# EAGLE schematic PicoCC (EAGLE 6.1)
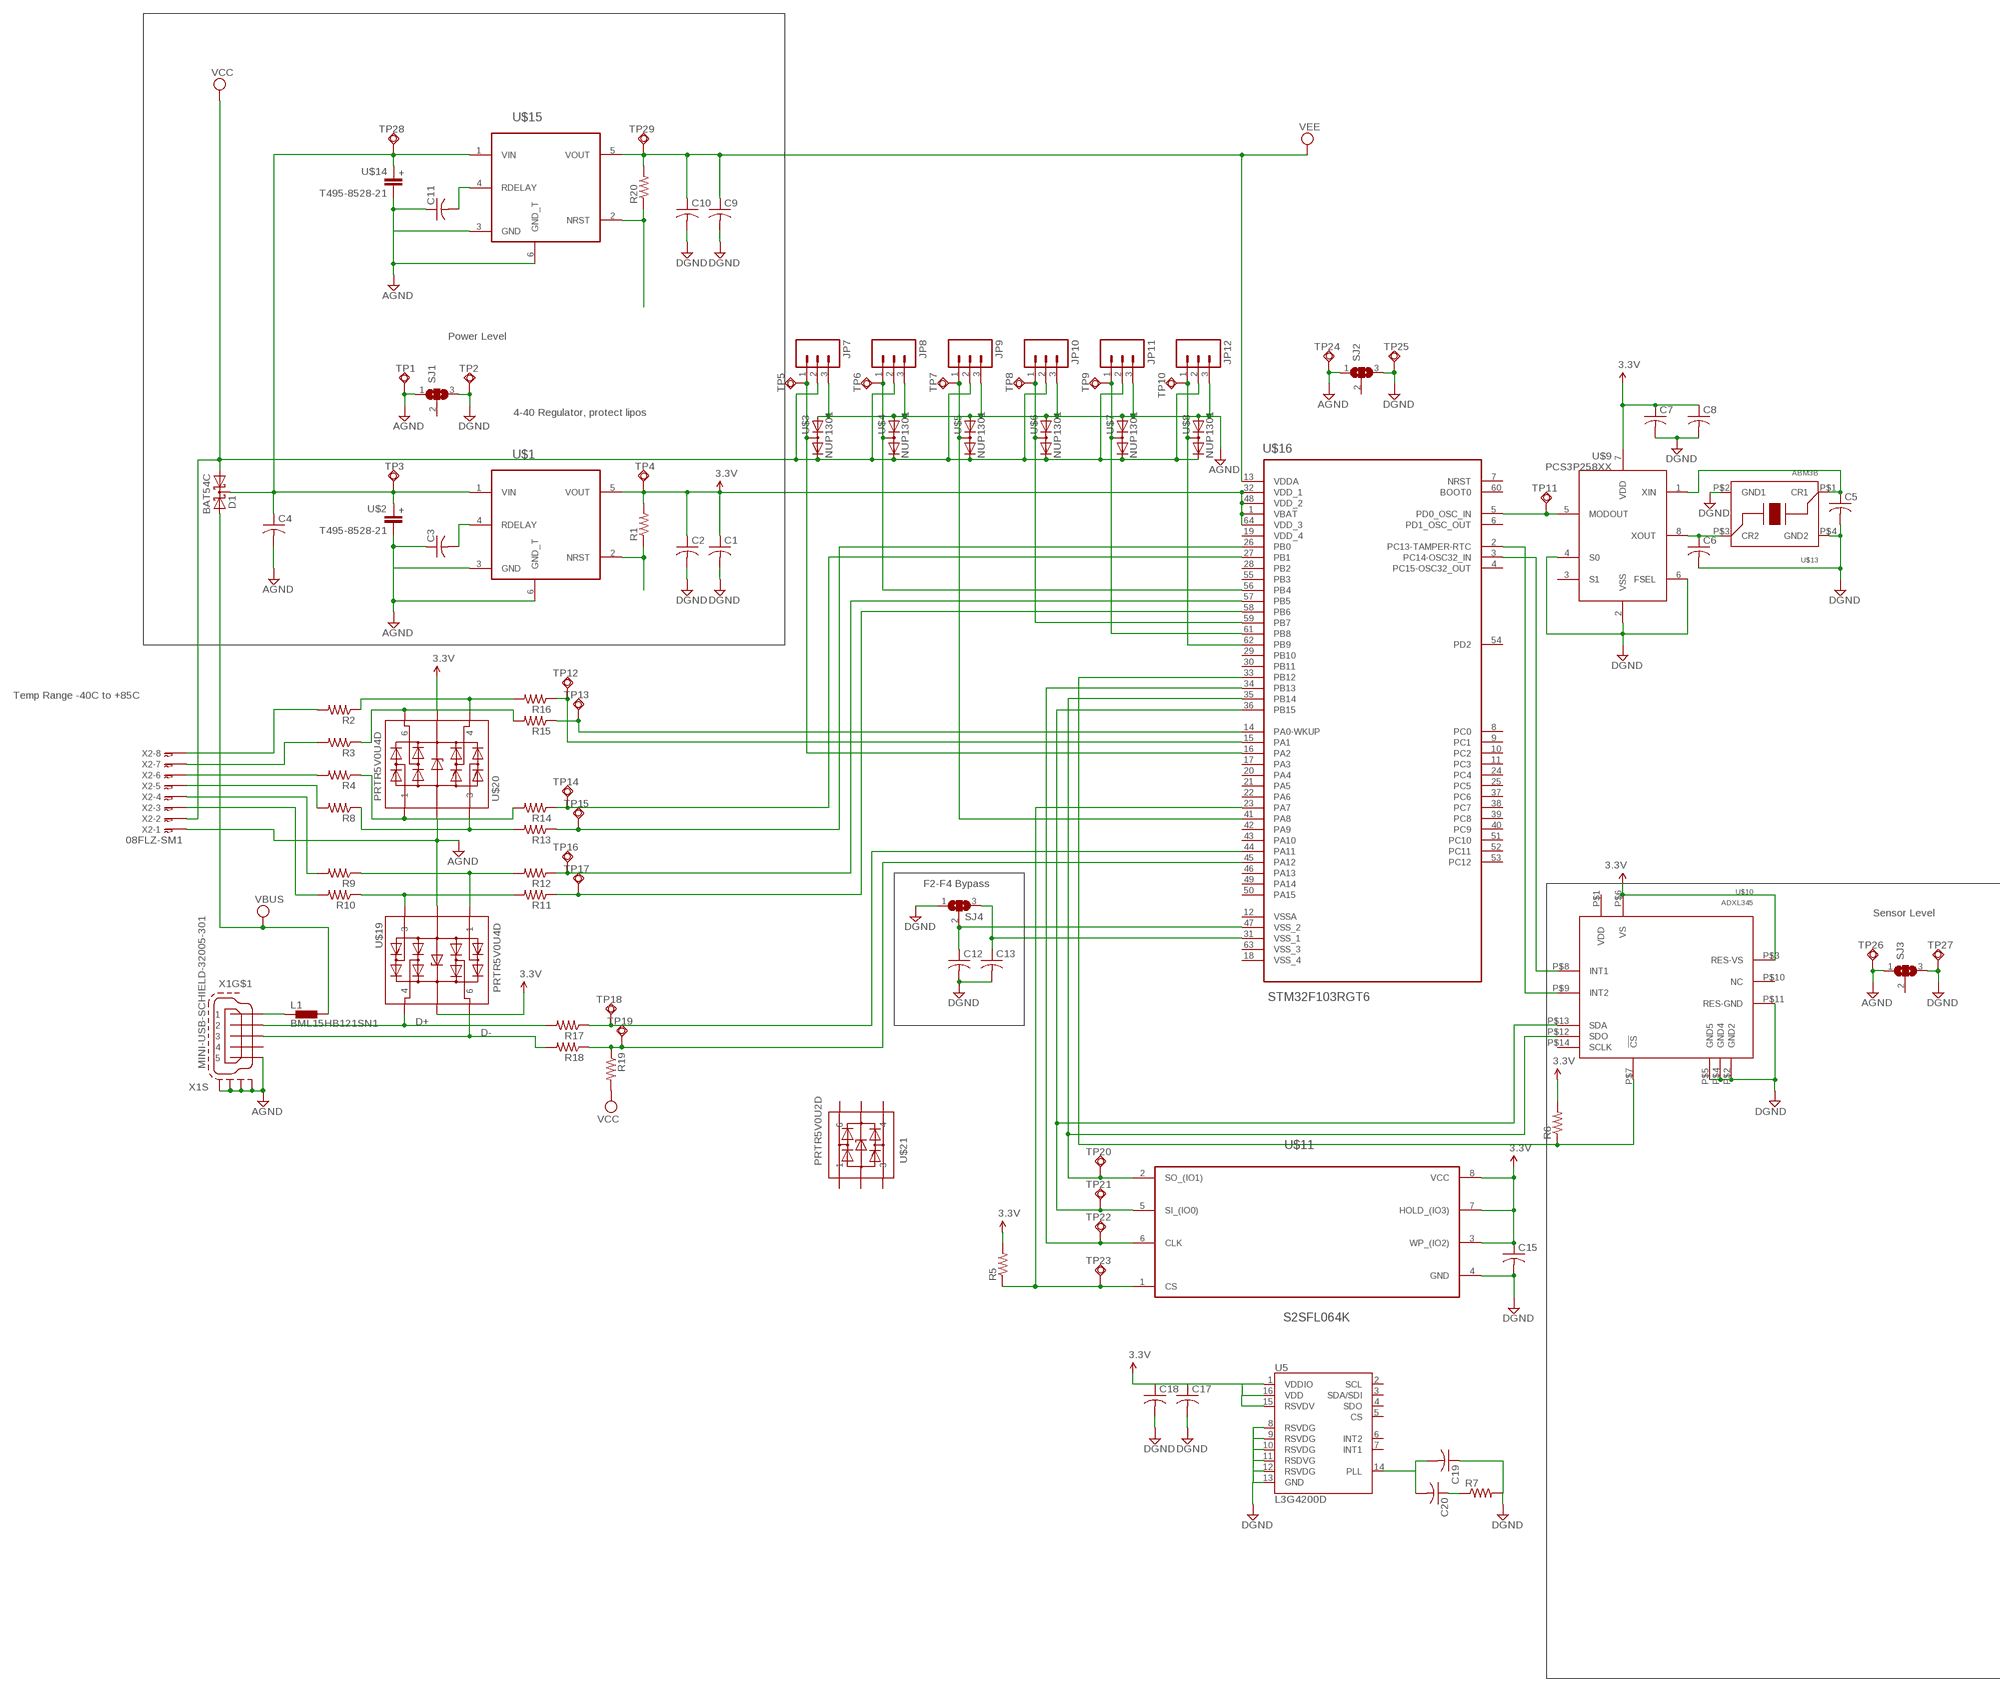
[diagram p0: schematic, sheet 1, part 1 of 2]
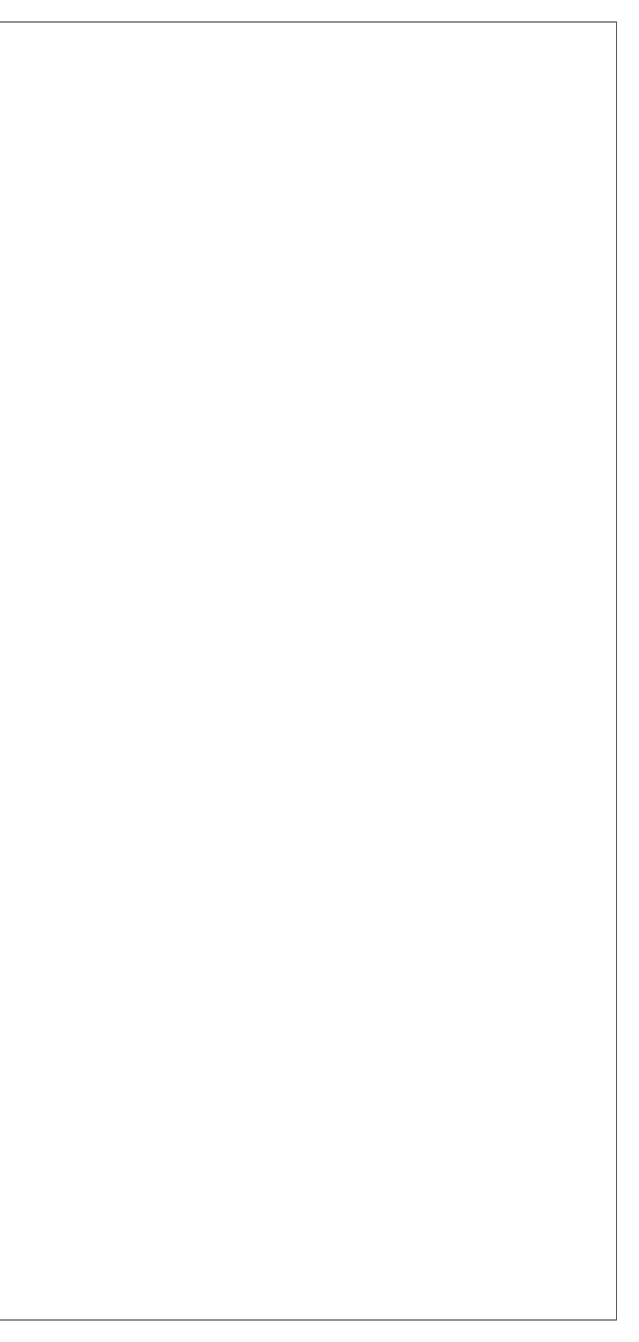
[diagram p1: schematic, sheet 1, part 2 of 2]

## Parts
C1  C-USC0402  [C0402]
C2  C-USC0402  [C0402]
C3  C-USC0402K  [C0402K]
C4  C-USC0402K  [C0402K]
C5  C-USC0402K  [C0402K]
C6  C-USC0402K  [C0402K]
C7  C-USC0402K  [C0402K]
C8  C-USC0402K  [C0402K]
C9  C-USC0402  [C0402]
C10  C-USC0402  [C0402]
C11  C-USC0402K  [C0402K]
C12  C-USC0402  [C0402]
C13  C-USC0402  [C0402]
C15  C-USC0402K  [C0402K]
C17  C-USC0402  [C0402]
C18  C-USC0402  [C0402]
C19  C-USC0402  [C0402]
C20  C-USC0402  [C0402]
D1  BAT54C  [SOT23]
JP7  M03POGO_PIN_HOLES_ONLY  [1X03_PP_HOLES_ONLY]
JP8  M03POGO_PIN_HOLES_ONLY  [1X03_PP_HOLES_ONLY]
JP9  M03POGO_PIN_HOLES_ONLY  [1X03_PP_HOLES_ONLY]
JP10  M03POGO_PIN_HOLES_ONLY  [1X03_PP_HOLES_ONLY]
JP11  M03POGO_PIN_HOLES_ONLY  [1X03_PP_HOLES_ONLY]
JP12  M03POGO_PIN_HOLES_ONLY  [1X03_PP_HOLES_ONLY]
L1  BML15HB121SN1  [0402]
R1  R-US_R0402  [R0402]
R2  R-US_R0402  [R0402]
R3  R-US_R0402  [R0402]
R4  R-US_R0402  [R0402]
R5  R-US_R0402  [R0402]
R6  R-US_R0402  [R0402]
R7  R-US_R0402  [R0402]
R8  R-US_R0402  [R0402]
R9  R-US_R0402  [R0402]
R10  R-US_R0402  [R0402]
R11  R-US_R0402  [R0402]
R12  R-US_R0402  [R0402]
R13  R-US_R0402  [R0402]
R14  R-US_R0402  [R0402]
R15  R-US_R0402  [R0402]
R16  R-US_R0402  [R0402]
R17  R-US_R0402  [R0402]
R18  R-US_R0402  [R0402]
R19  R-US_R0402  [R0402]
R20  R-US_R0402  [R0402]
SJ1  SJ2WW  [SJ_2W]
SJ2  SJ2WW  [SJ_2W]
SJ3  SJ2WW  [SJ_2W]
SJ4  SJ2W  [SJ_2]
TP1  TPSQTP12R  [TP12R]
TP2  TPSQTP12R  [TP12R]
TP3  TPSQTP12R  [TP12R]
TP4  TPSQTP12R  [TP12R]
TP5  TPSQTP12R  [TP12R]
TP6  TPSQTP12R  [TP12R]
TP7  TPSQTP12R  [TP12R]
TP8  TPSQTP12R  [TP12R]
TP9  TPSQTP12R  [TP12R]
TP10  TPSQTP12R  [TP12R]
TP11  TPSQTP12R  [TP12R]
TP12  TPSQTP12R  [TP12R]
TP13  TPSQTP12R  [TP12R]
TP14  TPSQTP12R  [TP12R]
TP15  TPSQTP12R  [TP12R]
TP16  TPSQTP12R  [TP12R]
TP17  TPSQTP12R  [TP12R]
TP18  TPSQTP12R  [TP12R]
TP19  TPSQTP12R  [TP12R]
TP20  TPSQTP12R  [TP12R]
TP21  TPSQTP12R  [TP12R]
TP22  TPSQTP12R  [TP12R]
TP23  TPSQTP12R  [TP12R]
TP24  TPSQTP12R  [TP12R]
TP25  TPSQTP12R  [TP12R]
TP26  TPSQTP12R  [TP12R]
TP27  TPSQTP12R  [TP12R]
TP28  TPSQTP12R  [TP12R]
TP29  TPSQTP12R  [TP12R]
U5  L3G4200D  [LGA16-4X4]
U$1  TPS7A6033-Q1  [TO-263-5]
U$2  T495-8528-21  [8528-21]
U$3  NUP1301  [SOT-23]
U$4  NUP1301  [SOT-23]
U$5  NUP1301  [SOT-23]
U$6  NUP1301  [SOT-23]
U$7  NUP1301  [SOT-23]
U$8  NUP1301  [SOT-23]
U$9  PCS3P258XX  [SO08]
U$10  ADXL345  [LGA14]
U$11  S2SFL064K  [SOIC127P600X175-8N]
U$13  ABM3B  [ABM3B]
U$14  T495-8528-21  [8528-21]
U$15  TPS7A6033-Q1  [TO-263-5]
U$16  STM32F103RGT6  [QFP50P1200X1200X160-64N]
U$19  PRTR5V0U4D  [SOT-457]
U$20  PRTR5V0U4D  [SOT-457]
U$21  PRTR5V0U2D  [SOT-457]
X1  MINI-USB-SCHIELD-32005-301  [32005-301]
X2  08FLZ-SM1  [8FLZ-SM]

## Nets
3.3V: C1.1 C2.1 C7.1 C8.1 C15.1 C17.1 C18.1 R1.2 R3.1 R5.2 R6.2 R15.2 TP4.TP U5.1(VDDIO) U5.15(RSVDV) U5.16(VDD) U$1.5(VOUT) U$9.7(VDD) U$10.P$3(RES-VS) U$10.P$6(VS) U$11.3(WP_(IO2)) U$11.7(HOLD_(IO3)) U$11.8(VCC) U$16.1(VBAT) U$16.32(VDD_1) U$16.48(VDD_2) U$16.64(VDD_3) U$19.5 U$20.6
AGND: C3.1 C4.2 C11.1 JP7.3 JP8.3 JP9.3 JP10.3 JP11.3 JP12.3 SJ1.1 SJ2.1 SJ3.1 TP1.TP TP24.TP TP26.TP U$1.3(GND) U$1.6(GND_T) U$2.NEG U$3.1 U$4.1 U$5.1 U$6.1 U$7.1 U$8.1 U$14.NEG U$15.3(GND) U$15.6(GND_T) U$19.2 U$20.2 X1.5 X1.M1(S:S1) X1.M2(S:S2) X1.M3(S:S3) X1.M4(S:S4) X2.1
D+: R17.2 U$19.4 X1.2
D+2: R17.1 TP18.TP U$16.44(PA11)
D-: R18.2 U$19.6 X1.3
D-2: R18.1 R19.1 TP19.TP U$16.45(PA12)
DGND: C1.2 C2.2 C5.2 C6.2 C7.2 C8.2 C9.2 C10.2 C12.2 C13.2 C15.2 C17.2 C18.2 C19.1 R7.2 SJ1.3 SJ2.3 SJ3.3 SJ4.1 TP2.TP TP25.TP TP27.TP U5.8(RSVDG) U5.9(RSVDG) U5.10(RSVDG) U5.11(RSDVG) U5.12(RSVDG) U5.13(GND) U$9.2(VSS) U$9.4(S0) U$9.6(FSEL) U$10.P$2(GND2) U$10.P$4(GND4) U$10.P$5(GND5) U$10.P$11(RES-GND) U$11.4(GND) U$13.P$2(GND1) U$13.P$4(GND2)
N$1: L1.1 X1.1
N$2: C4.1 D1.3(CC) TP3.TP TP28.TP U$1.1(VIN) U$2.POS U$14.POS U$15.1(VIN)
N$3: C12.1 SJ4.2 U$16.47(VSS_2)
N$4: C3.2 U$1.4(RDELAY)
N$5: C11.2 U$15.4(RDELAY)
N$6: R1.1 U$1.2(NRST)
N$7: R20.1 U$15.2(NRST)
N$8: JP7.1 TP5.TP U$3.3 U$16.16(PA2)
N$9: JP8.1 TP6.TP U$4.3 U$16.56(PB4)
N$10: JP9.1 TP7.TP U$5.3 U$16.41(PA8)
N$11: JP10.1 TP8.TP U$6.3 U$16.59(PB7)
N$12: JP11.1 TP9.TP U$7.3 U$16.61(PB8)
N$13: JP12.1 TP10.TP U$8.3 U$16.62(PB9)
N$14: TP11.TP U$9.5(MODOUT) U$16.5(PD0_OSC_IN)
N$15: R5.1 TP23.TP U$11.1(CS) U$16.23(PA7)
N$16: TP22.TP U$11.6(CLK) U$16.34(PB13)
N$17: TP21.TP U$10.P$13(SDA) U$11.5(SI_(IO0)) U$16.36(PB15)
N$18: TP20.TP U$10.P$12(SDO) U$11.2(SO_(IO1)) U$16.35(PB14)
N$19: R2.2 X2.8
N$20: C13.1 SJ4.3 U$16.31(VSS_1)
N$22: R8.2 X2.5
N$23: R3.2 X2.7
N$24: R10.2 X2.3
N$25: R9.2 X2.4
N$29: R4.2 X2.6
N$30: R16.1 TP12.TP U$16.15(PA1)
N$31: R15.1 TP13.TP U$16.14(PA0-WKUP)
N$32: R14.1 TP14.TP U$16.27(PB1)
N$33: R13.1 TP15.TP U$16.26(PB0)
N$34: R12.1 TP16.TP U$16.57(PB5)
N$35: R11.1 TP17.TP U$16.58(PB6)
N$36: R2.1 R16.2 U$20.4
N$37: C6.1 U$9.8(XOUT) U$13.P$3(CR2)
N$38: C5.1 U$9.1(XIN) U$13.P$1(CR1)
N$39: R4.1 R14.2 U$20.1
N$40: U$10.P$8(INT1) U$16.3(PC14-OSC32_IN)
N$41: U$10.P$9(INT2) U$16.2(PC13-TAMPER-RTC)
N$42: R8.1 R13.2 U$20.3
N$43: R6.1 U$10.P$7(!CS) U$16.33(PB12)
N$44: R10.1 R11.2 U$19.3
N$45: R9.1 R12.2 U$19.1
N$46: C20.1 R7.1
N$47: C19.2 C20.2 U5.14(PLL)
VCC: D1.1(A1) D1.2(A2) JP7.2 JP8.2 JP9.2 JP10.2 JP11.2 JP12.2 L1.2 R19.2 U$3.2 U$4.2 U$5.2 U$6.2 U$7.2 U$8.2 X2.2 ; supply symbol labelled VBUS
VEE: C9.1 C10.1 R20.2 TP29.TP U$15.5(VOUT) U$16.13(VDDA)
Unconnected: SJ1.2 SJ2.2 SJ3.2 U5.2(SCL) U5.3(SDA/SDI) U5.4(SDO) U5.5(CS) U5.6(INT2) U5.7(INT1) U$9.3(S1) U$10.P$10(NC) U$10.P$14(SCLK) U$16.4(PC15-OSC32_OUT) U$16.6(PD1_OSC_OUT) U$16.7(NRST) U$16.8(PC0) U$16.9(PC1) U$16.10(PC2) U$16.11(PC3) U$16.12(VSSA) U$16.17(PA3) U$16.18(VSS_4) U$16.20(PA4) U$16.21(PA5) U$16.22(PA6) U$16.24(PC4) U$16.25(PC5) U$16.28(PB2) U$16.29(PB10) U$16.30(PB11) U$16.37(PC6) U$16.38(PC7) U$16.39(PC8) U$16.40(PC9) U$16.42(PA9) U$16.43(PA10) U$16.46(PA13) U$16.49(PA14) U$16.50(PA15) U$16.51(PC10) U$16.52(PC11) U$16.53(PC12) U$16.54(PD2) U$16.55(PB3) U$16.60(BOOT0) U$16.63(VSS_3) U$20.5 U$21.1 U$21.2 U$21.3 U$21.4 U$21.5 U$21.6 X1.4

## Notes on the sheet
- Power Level
- 4-40 Regulator, protect lipos
- Temp Range -40C to +85C
- F2-F4 Bypass
- Sensor Level

## Power pins joined to a net without a drawn wire
VDD: U$10.P$1(VDD)
VDD_4: U$16.19(VDD_4)

## Library data of the parts
C1-C13 C15 C17-C20 = rcl:C-US: CAPACITOR, American symbol
D1 = diode:BAT54C: Schottky Diodes Source: Fairchild .. BAT54.pdf
JP7-JP12 = SparkFun:M03: Header 3 Standard 3-pin 0.1" header. Use with straight break away headers (SKU : PRT-00116), right angle break away headers (PRT-00553), swiss pins (PRT-00743), machine pins (PRT-00117), and female headers (PRT-00115). Molex polarized connector foot print use with SKU : PRT-08232 with associated crimp pins and housings.
L1 = inductors:BML15H: EMIFIL (R) Chip Ferrite Bead for GHz Noise Source: http://www.murata.com/ Ferrite Bead BLM15H.pdf
R1-R20 = rcl:R-US_: RESISTOR, American symbol
SJ1-SJ4 = jumper:SJ2W: SMD solder JUMPER
TP1-TP29 = testpad:TPSQ: Test pad
U5 = SparkFun:L3G4200D: L3G4200D Three-axis, digital output gyroscope The L3G4200D is a low-power three-axis angular rate sensor, has a full scale of ±250/±500/±2000 dps and is capable of measuring rates with a user-selectable bandwidth. It includes a sensing element and an IC interface capable of providing the measured angular rate to the external world through a digital interface (I2C/SPI). Package: 4x4x1.1 LGA-16 (LGA16-4x4.PAC)
U$1 U$15 = TI_TPS:TPS7A6033-Q1: TPS7A6033-Q1
U$2 U$14 = Kemet:T495-8528-21: T495 Surge Robust Low ESR Capacitor, 3528-21 Package
U$3-U$8 = NXP:NUP1301
U$9 = on-semiconductor:PCS3P258XX: Spread Spectrum Clock Generator for EMI Protection
U$10 = analog-devices:ADXL345: ADXL345 3 Axis Accelerometer
U$11 = SPANSION:S2SFL064K
U$13 = ABRACON:ABM3B
U$16 = st-microelectronics:STM32F103RGT6: STM32F103RGT6
U$19 U$20 = NXP:PRTR5V0U4D: Integrated Quad ultra-low capacitance ESD Protection
U$21 = NXP:PRTR5V0U2D: Ultra low capacitance double rail-to-rail ESD Protection
X1 = con-cypressindustries:MINI-USB-SCHIELD-: MINI USB-B Conector Source: www.cypressindustries.com; OC_FARNELL: unknown; OC_NEWARK: unknown
X2 = con-jst:08FLZ-SM1: CONNECTOR; OC_FARNELL: unknown; OC_NEWARK: unknown